# Altium schematic sheet 06_SOM_USB_CARD.SchDoc
size 420 x 297 mm; SheetNumber: 12; SheetTotal: 24
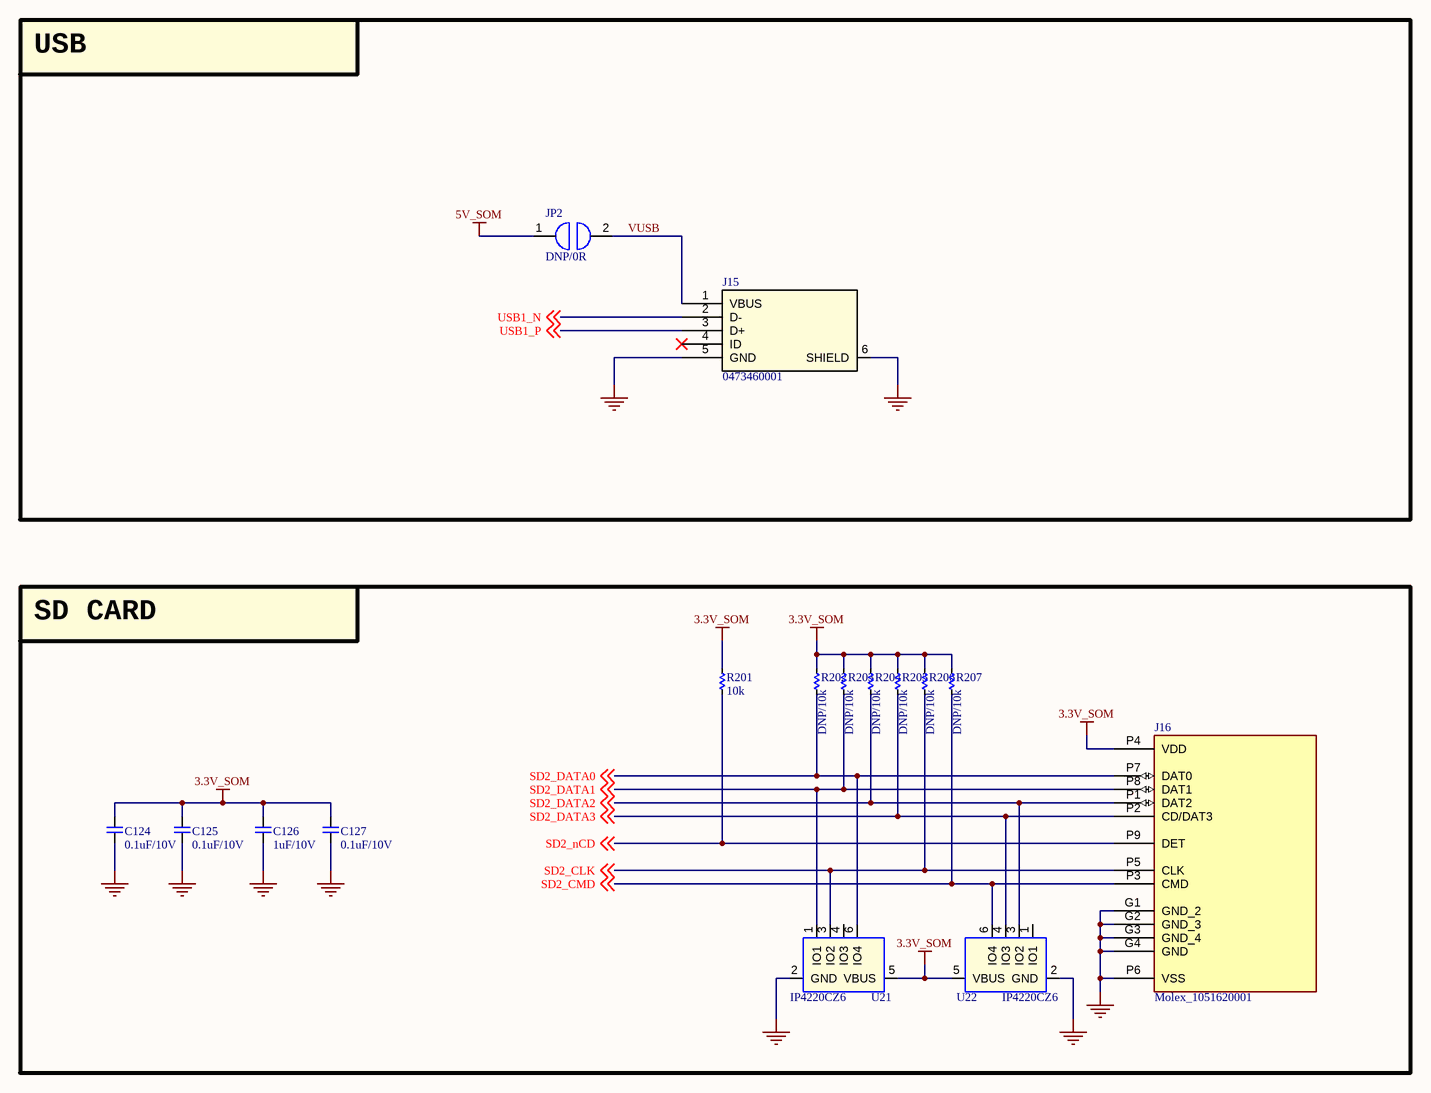
[diagram p0: 06_SOM_USB_CARD.SchDoc]

## Parts
C124  0.1uF/10V  [CAP_C_1005X60]
C125  0.1uF/10V  [CAP_C_1005X60]
C126  1uF/10V  [CAP_C_1005X60]
C127  0.1uF/10V  [CAP_C_1005X60]
J15  0473460001  [47346-0001_MOL]
J16  Molex_1051620001  [Molex_1051620001]
JP2  DNP/0R  [RES_C_1608X60]
R201  10k  [RES_C_1005X40]
R202  DNP/10k  [RES_C_1005X40]
R203  DNP/10k  [RES_C_1005X40]
R204  DNP/10k  [RES_C_1005X40]
R205  DNP/10k  [RES_C_1005X40]
R206  DNP/10k  [RES_C_1005X40]
R207  DNP/10k  [RES_C_1005X40]
U21  IP4220CZ6  [SOT95P280X145-6N]
U22  IP4220CZ6  [SOT95P280X145-6N]

## Blocks framed on the sheet
USB: J15 JP2
SD CARD: C124-C127 J16 R201-R207 U21 U22

## Nets
3.3V_SOM: C124.2 C125.2 C126.2 C127.2 J16.P4(VDD) R201.2 R202.2 R203.2 R204.2 R205.2 R206.2 R207.2 U21.5(VBUS) U22.5(VBUS)
5V_SOM: JP2.1
GND: C124.1 C125.1 C126.1 C127.1 J15.5(GND) J15.6(SHIELD) J16.G1(GND_2) J16.G2(GND_3) J16.G3(GND_4) J16.G4(GND) J16.P6(VSS) U21.2(GND) U22.2(GND)
SD2_CLK: J16.P5(CLK) R206.1 U21.3(IO2) ; off-sheet SD2_CLK
SD2_CMD: J16.P3(CMD) R207.1 U22.6(IO4) ; off-sheet SD2_CMD
SD2_DATA0: J16.P7(DAT0) R202.1 U21.6(IO4) ; off-sheet SD2_DATA0
SD2_DATA1: J16.P8(DAT1) R203.1 U21.1(IO1) ; off-sheet SD2_DATA1
SD2_DATA2: J16.P1(DAT2) R204.1 U22.3(IO2) ; off-sheet SD2_DATA2
SD2_DATA3: J16.P2(CD/DAT3) R205.1 U22.4(IO3) ; off-sheet SD2_DATA3
SD2_nCD: J16.P9(DET) R201.1 ; off-sheet SD2_nCD
USB1_N: J15.2(D-) ; off-sheet USB1_N
USB1_P: J15.3(D+) ; off-sheet USB1_P
VUSB: J15.1(VBUS) JP2.2

Not connected (* = marked no-connect by the designer): J15 4(ID)*; U21 4(IO3); U22 1(IO1)

## Notes on the sheet
- Project:
- BEE-PC1
- Sub-system:
- NANORACK_EXP_CONTROLLER
- Design by:
- SANG HUYNH
- BAO BUI Q.
- Sheet title:
- Sheet
- A3
- of
- Checked by:
- Approved by:
- VU PHAM
- Revision:
- Document No:
- V1.2.2
- Size:
- Date:

## Library data of the parts
C124-C127 = _CAP_C_2: CAP CHIP
J15 = USB_micro: No Description Available; Mfr_Name: Molex Connector Corporation; RefDes: RefDes; Type: Type
J16 = Molex_1051620001: 9 (8 + 1) Position Card Connector Secure Digital - microSDâ„¢ Surface Mount, Right Angle Gold; MF: Molex; SnapEDA_Link: https://www.snapeda.com/parts/1051620001/Molex/view-part/?ref=snap; Package: None; Value: *; MP: 1051620001; Check_prices: https://www.snapeda.com/parts/1051620001/Molex/view-part/?ref=eda
JP2 = JUMPER
R201-R207 = _RES_B_2: RES
U21 U22 = IP4220CZ6_0: P/N: 132D42200S; PCB Footprint: SOT23-6L; CLABCONF0: =SB-UCMIMX93